# Altium schematic sheet proj_arhipov_mcu.SchDoc: =title_line_1 + title_line_2
size 840 x 594 mm; SheetNumber: 1
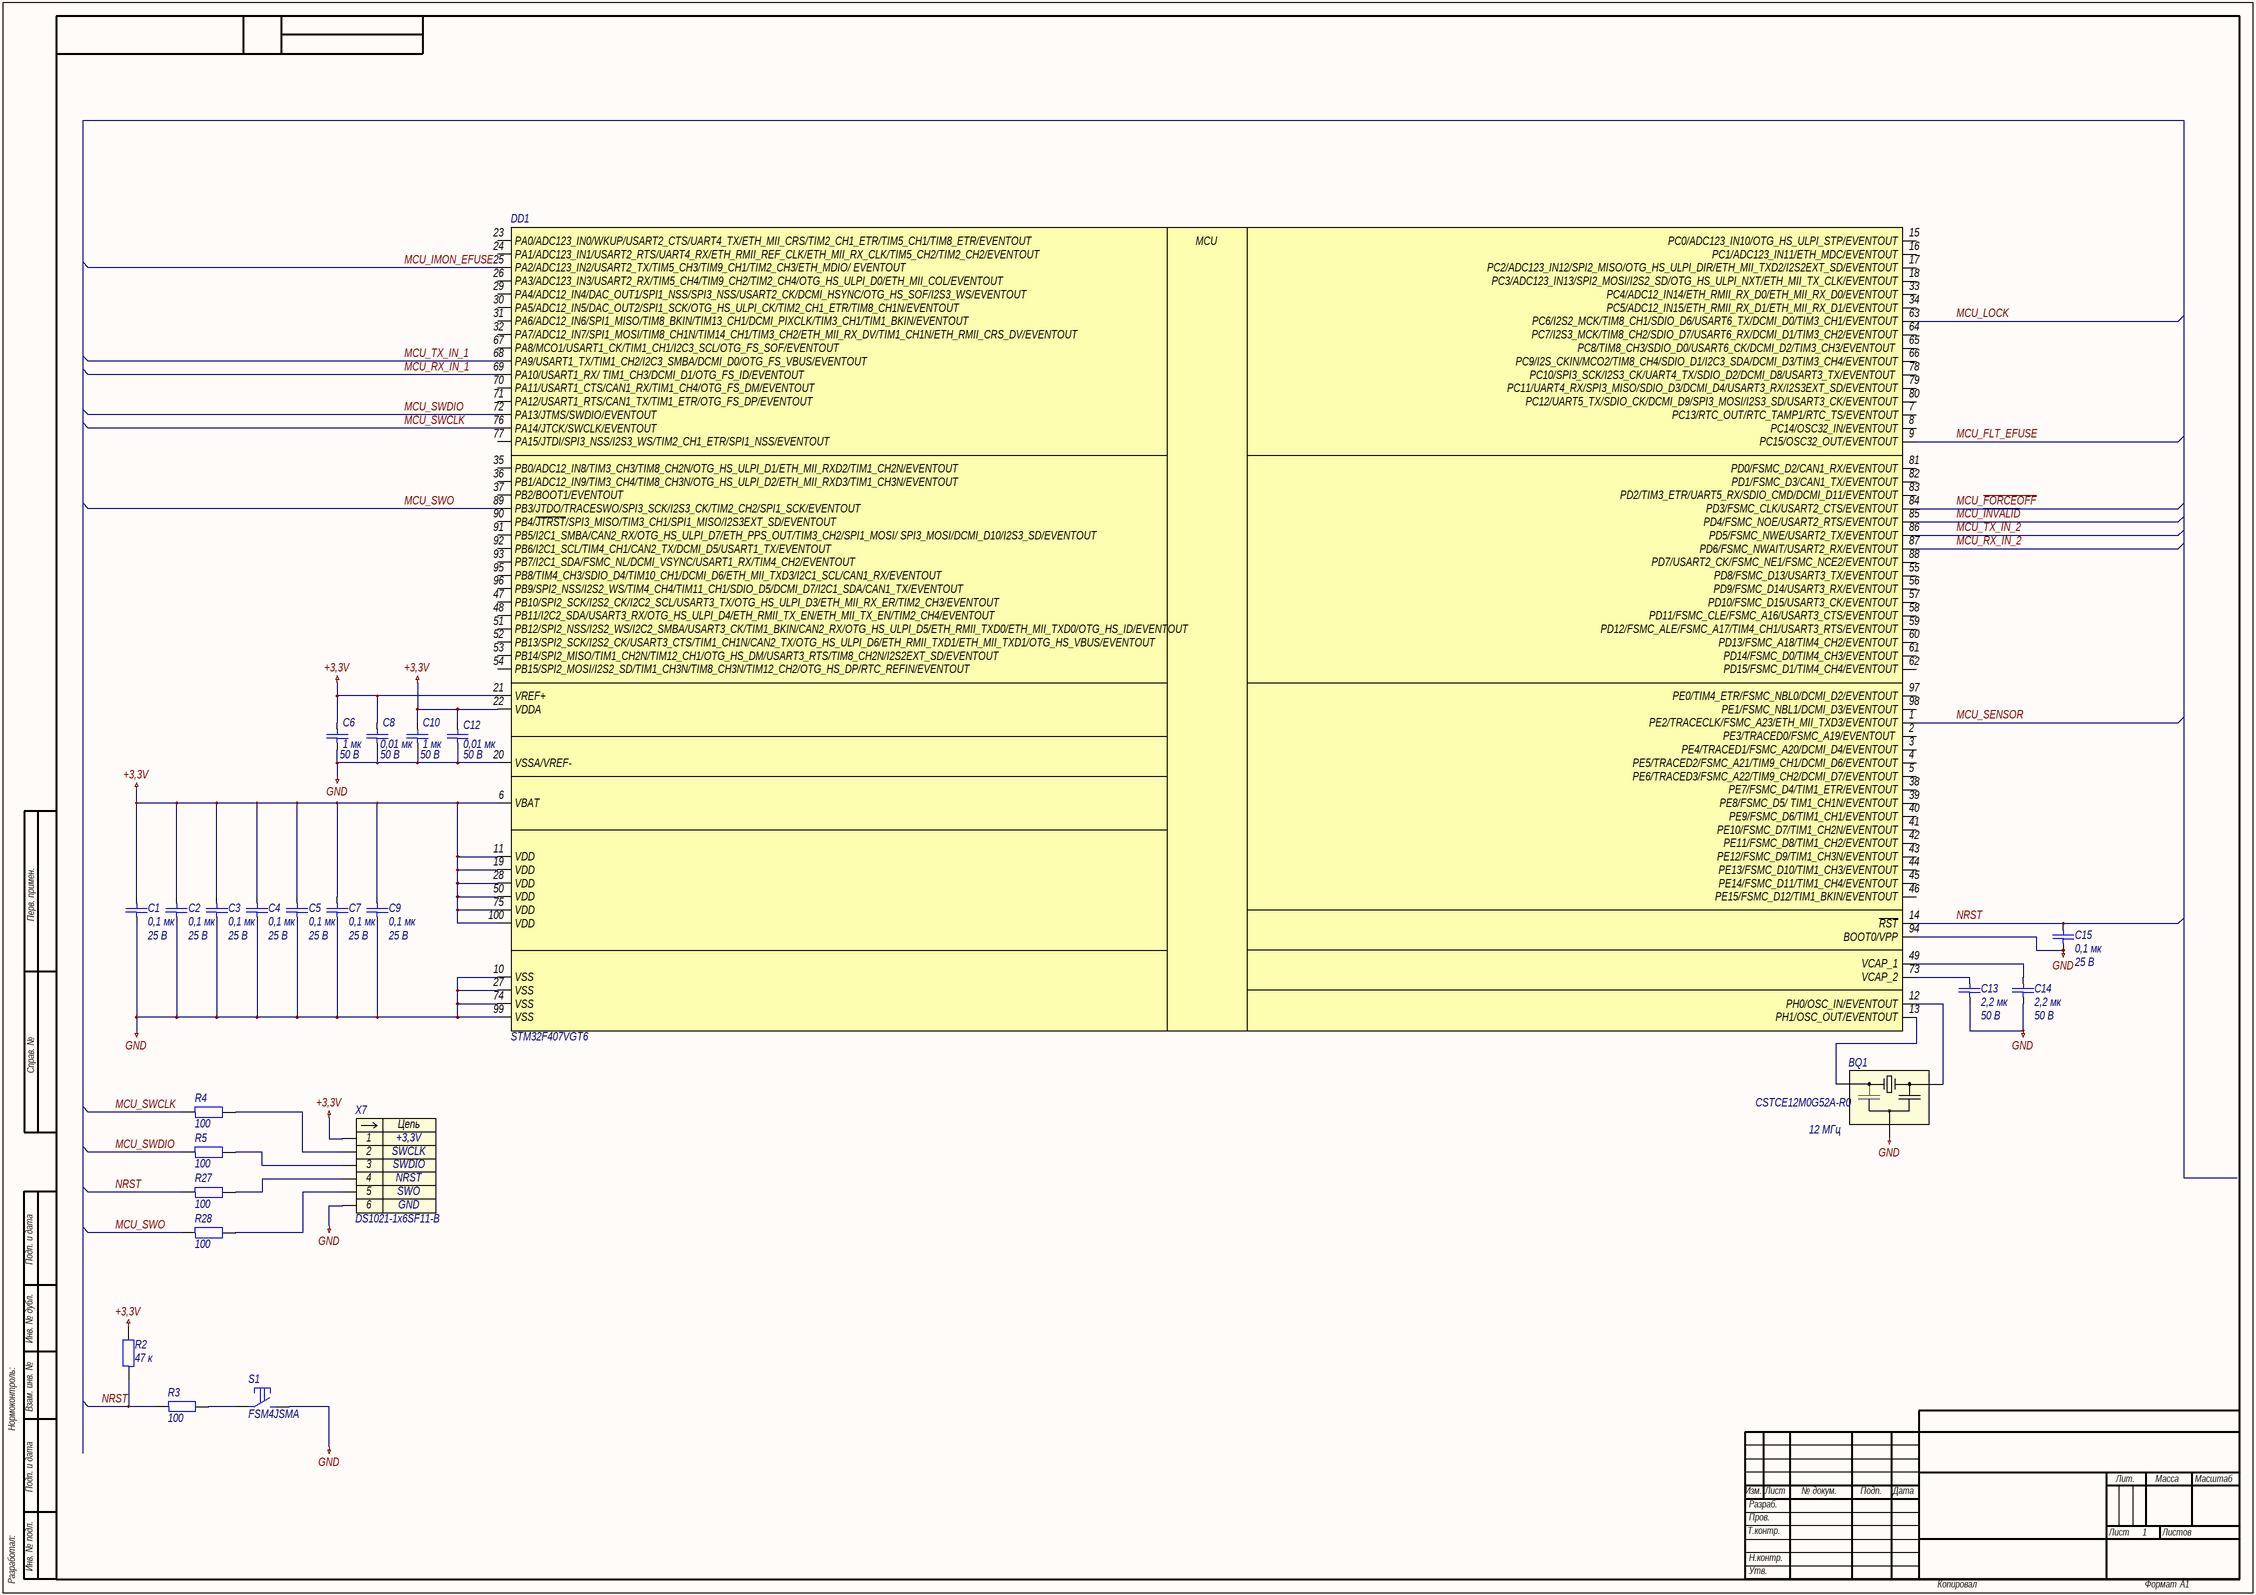
[diagram p0: proj_arhipov_mcu.SchDoc]

## Parts
BQ1  CSTCE12M0G52A-R0  Частотa: 12 МГц  [CSTCE-3-320X130X70]
C1  0,1 мк  Напряжение: 25 В  [C0603]
C2  0,1 мк  Напряжение: 25 В  [C0603]
C3  0,1 мк  Напряжение: 25 В  [C0603]
C4  0,1 мк  Напряжение: 25 В  [C0603]
C5  0,1 мк  Напряжение: 25 В  [C0603]
C6  1 мк  Напряжение: 50 В  [C0603]
C7  0,1 мк  Напряжение: 25 В  [C0603]
C8  0,01 мк  Напряжение: 50 В  [C0603]
C9  0,1 мк  Напряжение: 25 В  [C0603]
C10  1 мк  Напряжение: 50 В  [C0603]
C12  0,01 мк  Напряжение: 50 В  [C0603]
C13  2,2 мк  Напряжение: 50 В  [C0603]
C14  2,2 мк  Напряжение: 50 В  [C0603]
C15  0,1 мк  Напряжение: 25 В  [C0603]
DD1  STM32F407VGT6  [LQFP-100-P50-1400X1400X160-L60X22]
R2  47 к  [R0603]
R3  100  [R0603]
R4  100  [R0603]
R5  100  [R0603]
R27  100  [R0603]
R28  100  [R0603]
S1  FSM4JSMA  [FSM4JSMA]
X7  DS1021-1x6SF11-B  [DS1021-1X6SF11-B]

## Nets
+3,3V: C1.1 C2.1 C3.1 C4.1 C5.1 C6.1 C7.1 C8.1 C9.1 C10.1 C12.1 DD1.6(VBAT) DD1.11(VDD) DD1.19(VDD) DD1.21(VREF+) DD1.22(VDDA) DD1.28(VDD) DD1.50(VDD) DD1.75(VDD) DD1.100(VDD) R2.2 X7.1
GND: BQ1.2 C1.2 C2.2 C3.2 C4.2 C5.2 C6.2 C7.2 C8.2 C9.2 C10.2 C12.2 C13.2 C14.2 C15.2 DD1.10(VSS) DD1.20(VSSA/VREF-) DD1.27(VSS) DD1.74(VSS) DD1.94(BOOT0/VPP) DD1.99(VSS) S1.2 X7.6
MCU_~{FORCEOFF}: DD1.84(PD3/FSMC_CLK/USART2_CTS/EVENTOUT)
MCU_FLT_EFUSE: DD1.9(PC15/OSC32_OUT/EVENTOUT)
MCU_~{INVALID}: DD1.85(PD4/FSMC_NOE/USART2_RTS/EVENTOUT)
MCU_IMON_EFUSE: DD1.25(PA2/ADC123_IN2/USART2_TX/TIM5_CH3/TIM9_CH1/TIM2_CH3/ETH_MDIO/_EVENTOUT)
MCU_LOCK: DD1.63(PC6/I2S2_MCK/TIM8_CH1/SDIO_D6/USART6_TX/DCMI_D0/TIM3_CH1/EVENTOUT)
MCU_RX_IN_1: DD1.69(PA10/USART1_RX/_TIM1_CH3/DCMI_D1/OTG_FS_ID/EVENTOUT)
MCU_RX_IN_2: DD1.87(PD6/FSMC_NWAIT/USART2_RX/EVENTOUT)
MCU_SENSOR: DD1.1(PE2/TRACECLK/FSMC_A23/ETH_MII_TXD3/EVENTOUT)
MCU_SWCLK: DD1.76(PA14/JTCK/SWCLK/EVENTOUT) R4.1
MCU_SWDIO: DD1.72(PA13/JTMS/SWDIO/EVENTOUT) R5.1
MCU_SWO: DD1.89(PB3/JTDO/TRACESWO/SPI3_SCK/I2S3_CK/TIM2_CH2/SPI1_SCK/EVENTOUT) R28.1
MCU_TX_IN_1: DD1.68(PA9/USART1_TX/TIM1_CH2/I2C3_SMBA/DCMI_D0/OTG_FS_VBUS/EVENTOUT)
MCU_TX_IN_2: DD1.86(PD5/FSMC_NWE/USART2_TX/EVENTOUT)
NRST: C15.1 DD1.14(~{RST}) R2.1 R3.1 R27.1
NetBQ1_1: BQ1.1 DD1.12(PH0/OSC_IN/EVENTOUT)
NetBQ1_3: BQ1.3 DD1.13(PH1/OSC_OUT/EVENTOUT)
NetC13_1: C13.1 DD1.73(VCAP_2)
NetC14_1: C14.1 DD1.49(VCAP_1)
NetR3_2: R3.2 S1.1
NetR4_2: R4.2 X7.2
NetR5_2: R5.2 X7.3
NetR27_2: R27.2 X7.4
NetR28_2: R28.2 X7.5

Not connected (* = marked no-connect by the designer): DD1 2(PE3/TRACED0/FSMC_A19/EVENTOUT_) 3(PE4/TRACED1/FSMC_A20/DCMI_D4/EVENTOUT) 4(PE5/TRACED2/FSMC_A21/TIM9_CH1/DCMI_D6/EVENTOUT) 5(PE6/TRACED3/FSMC_A22/TIM9_CH2/DCMI_D7/EVENTOUT) 7(PC13/RTC_OUT/RTC_TAMP1/RTC_TS/EVENTOUT) 8(PC14/OSC32_IN/EVENTOUT) 15(PC0/ADC123_IN10/OTG_HS_ULPI_STP/EVENTOUT) 16(PC1/ADC123_IN11/ETH_MDC/EVENTOUT) 17(PC2/ADC123_IN12/SPI2_MISO/OTG_HS_ULPI_DIR/ETH_MII_TXD2/I2S2EXT_SD/EVENTOUT) 18(PC3/ADC123_IN13/SPI2_MOSI/I2S2_SD/OTG_HS_ULPI_NXT/ETH_MII_TX_CLK/EVENTOUT) 23(PA0/ADC123_IN0/WKUP/USART2_CTS/UART4_TX/ETH_MII_CRS/TIM2_CH1_ETR/TIM5_CH1/TIM8_ETR/EVENTOUT) 24(PA1/ADC123_IN1/USART2_RTS/UART4_RX/ETH_RMII_REF_CLK/ETH_MII_RX_CLK/TIM5_CH2/TIM2_CH2/EVENTOUT) 26(PA3/ADC123_IN3/USART2_RX/TIM5_CH4/TIM9_CH2/TIM2_CH4/OTG_HS_ULPI_D0/ETH_MII_COL/EVENTOUT) 29(PA4/ADC12_IN4/DAC_OUT1/SPI1_NSS/SPI3_NSS/USART2_CK/DCMI_HSYNC/OTG_HS_SOF/I2S3_WS/EVENTOUT) 30(PA5/ADC12_IN5/DAC_OUT2/SPI1_SCK/OTG_HS_ULPI_CK/TIM2_CH1_ETR/TIM8_CH1N/EVENTOUT) 31(PA6/ADC12_IN6/SPI1_MISO/TIM8_BKIN/TIM13_CH1/DCMI_PIXCLK/TIM3_CH1/TIM1_BKIN/EVENTOUT) 32(PA7/ADC12_IN7/SPI1_MOSI/TIM8_CH1N/TIM14_CH1/TIM3_CH2/ETH_MII_RX_DV/TIM1_CH1N/ETH_RMII_CRS_DV/EVENTOUT) 33(PC4/ADC12_IN14/ETH_RMII_RX_D0/ETH_MII_RX_D0/EVENTOUT) 34(PC5/ADC12_IN15/ETH_RMII_RX_D1/ETH_MII_RX_D1/EVENTOUT) 35(PB0/ADC12_IN8/TIM3_CH3/TIM8_CH2N/OTG_HS_ULPI_D1/ETH_MII_RXD2/TIM1_CH2N/EVENTOUT) 36(PB1/ADC12_IN9/TIM3_CH4/TIM8_CH3N/OTG_HS_ULPI_D2/ETH_MII_RXD3/TIM1_CH3N/EVENTOUT) 37(PB2/BOOT1/EVENTOUT) 38(PE7/FSMC_D4/TIM1_ETR/EVENTOUT) 39(PE8/FSMC_D5/_TIM1_CH1N/EVENTOUT) 40(PE9/FSMC_D6/TIM1_CH1/EVENTOUT) 41(PE10/FSMC_D7/TIM1_CH2N/EVENTOUT) 42(PE11/FSMC_D8/TIM1_CH2/EVENTOUT) 43(PE12/FSMC_D9/TIM1_CH3N/EVENTOUT) 44(PE13/FSMC_D10/TIM1_CH3/EVENTOUT) 45(PE14/FSMC_D11/TIM1_CH4/EVENTOUT) 46(PE15/FSMC_D12/TIM1_BKIN/EVENTOUT) 47(PB10/SPI2_SCK/I2S2_CK/I2C2_SCL/USART3_TX/OTG_HS_ULPI_D3/ETH_MII_RX_ER/TIM2_CH3/EVENTOUT) 48(PB11/I2C2_SDA/USART3_RX/OTG_HS_ULPI_D4/ETH_RMII_TX_EN/ETH_MII_TX_EN/TIM2_CH4/EVENTOUT) 51(PB12/SPI2_NSS/I2S2_WS/I2C2_SMBA/USART3_CK/TIM1_BKIN/CAN2_RX/OTG_HS_ULPI_D5/ETH_RMII_TXD0/ETH_MII_TXD0/OTG_HS_ID/EVENTOUT) 52(PB13/SPI2_SCK/I2S2_CK/USART3_CTS/TIM1_CH1N/CAN2_TX/OTG_HS_ULPI_D6/ETH_RMII_TXD1/ETH_MII_TXD1/OTG_HS_VBUS/EVENTOUT) 53(PB14/SPI2_MISO/TIM1_CH2N/TIM12_CH1/OTG_HS_DM/USART3_RTS/TIM8_CH2N/I2S2EXT_SD/EVENTOUT) 54(PB15/SPI2_MOSI/I2S2_SD/TIM1_CH3N/TIM8_CH3N/TIM12_CH2/OTG_HS_DP/RTC_REFIN/EVENTOUT) 55(PD8/FSMC_D13/USART3_TX/EVENTOUT) 56(PD9/FSMC_D14/USART3_RX/EVENTOUT) 57(PD10/FSMC_D15/USART3_CK/EVENTOUT) 58(PD11/FSMC_CLE/FSMC_A16/USART3_CTS/EVENTOUT) 59(PD12/FSMC_ALE/FSMC_A17/TIM4_CH1/USART3_RTS/EVENTOUT) 60(PD13/FSMC_A18/TIM4_CH2/EVENTOUT) 61(PD14/FSMC_D0/TIM4_CH3/EVENTOUT) 62(PD15/FSMC_D1/TIM4_CH4/EVENTOUT) 64(PC7/I2S3_MCK/TIM8_CH2/SDIO_D7/USART6_RX/DCMI_D1/TIM3_CH2/EVENTOUT) 65(PC8/TIM8_CH3/SDIO_D0/USART6_CK/DCMI_D2/TIM3_CH3/EVENTOUT_) 66(PC9/I2S_CKIN/MCO2/TIM8_CH4/SDIO_D1/I2C3_SDA/DCMI_D3/TIM3_CH4/EVENTOUT) 67(PA8/MCO1/USART1_CK/TIM1_CH1/I2C3_SCL/OTG_FS_SOF/EVENTOUT) 70(PA11/USART1_CTS/CAN1_RX/TIM1_CH4/OTG_FS_DM/EVENTOUT) 71(PA12/USART1_RTS/CAN1_TX/TIM1_ETR/OTG_FS_DP/EVENTOUT) 77(PA15/JTDI/SPI3_NSS/I2S3_WS/TIM2_CH1_ETR/SPI1_NSS/EVENTOUT) 78(PC10/SPI3_SCK/I2S3_CK/UART4_TX/SDIO_D2/DCMI_D8/USART3_TX/EVENTOUT_) 79(PC11/UART4_RX/SPI3_MISO/SDIO_D3/DCMI_D4/USART3_RX/I2S3EXT_SD/EVENTOUT) 80(PC12/UART5_TX/SDIO_CK/DCMI_D9/SPI3_MOSI/I2S3_SD/USART3_CK/EVENTOUT) 81(PD0/FSMC_D2/CAN1_RX/EVENTOUT) 82(PD1/FSMC_D3/CAN1_TX/EVENTOUT) 83(PD2/TIM3_ETR/UART5_RX/SDIO_CMD/DCMI_D11/EVENTOUT) 88(PD7/USART2_CK/FSMC_NE1/FSMC_NCE2/EVENTOUT) 90(PB4/~{JTRST}/SPI3_MISO/TIM3_CH1/SPI1_MISO/I2S3EXT_SD/EVENTOUT) 91(PB5/I2C1_SMBA/CAN2_RX/OTG_HS_ULPI_D7/ETH_PPS_OUT/TIM3_CH2/SPI1_MOSI/_SPI3_MOSI/DCMI_D10/I2S3_SD/EVENTOUT) 92(PB6/I2C1_SCL/TIM4_CH1/CAN2_TX/DCMI_D5/USART1_TX/EVENTOUT) 93(PB7/I2C1_SDA/FSMC_NL/DCMI_VSYNC/USART1_RX/TIM4_CH2/EVENTOUT) 95(PB8/TIM4_CH3/SDIO_D4/TIM10_CH1/DCMI_D6/ETH_MII_TXD3/I2C1_SCL/CAN1_RX/EVENTOUT) 96(PB9/SPI2_NSS/I2S2_WS/TIM4_CH4/TIM11_CH1/SDIO_D5/DCMI_D7/I2C1_SDA/CAN1_TX/EVENTOUT) 97(PE0/TIM4_ETR/FSMC_NBL0/DCMI_D2/EVENTOUT) 98(PE1/FSMC_NBL1/DCMI_D3/EVENTOUT)

## Notes on the sheet
- Перв. примен.
- Справ. №
- Подп. и дата
- Инв. № дубл.
- Нормоконтроль:
- Взам. инв. №
- Изм.
- Лист
- № докум.
- Подп.
- Дата
- Лит.
- Масса
- Масштаб
- Т.контр.
- Пров.
- Разраб.
- Листов
- Разработал:
- Инв. № подл.
- Н.контр.
- Утв.
- Копировал
- Формат
- А1
- (in symbol dd0001) MCU
- (in symbol x0016) Цепь

## Library data of the parts
BQ1 = bq0001: =Описание; ID: bq0001; Фамилия: Самарин; Описание: Кварцевый резонатор 12 МГц; Производитель: Murata Manufacturing Co., Ltd.; Корпус: 3,20 x 1,30 x 0,70; Наименование: CSTCE12M0G52A-R0; Частота: 12 МГц; HelpURL: https://www.murata.com/en-us/products/productdetail?partno=CSTCE12M0G52A-R0
C1-C5 C7 C9 C15 = c0058: =Описание; ID: c0058; Фамилия: Паньков; Описание: Конденсатор керамический чип 0603 100 нФ 25 В ±10 %; Наименование: CC0603KRX7R8BB104; Производитель: YAGEO Corp.; Отклонение: ±10 %; Рабочие температуры: от –55 °С до +125 °С; Температурный коэффициент емкости: X7R; Корпус: 0603; Номинал: 0,1 мк; Номинальное напряжение: 25 В; HelpURL: https://www.yageo.com/upload/media/product/productsearch/datasheet/mlcc/UPY-GPHC_X7R_6.3V-to-50V_20.pdf
C6 C10 = c0091: =Описание; ID: c0091; Фамилия: Самарин; Описание: Конденсатор керамический чип 0603 1 мкФ 50 В ±10 %; Наименование: CC0603KPX5R9BB105; Производитель: YAGEO Corp.; Отклонение: ±10 %; Рабочие температуры: от –55 °С до +85 °С; Температурный коэффициент емкости: X5R; Корпус: 0603; Номинал: 1 мк; Номинальное напряжение: 50 В; HelpURL: https://www.yageo.com/upload/media/product/productsearch/datasheet/mlcc/UPY-GPHC_X5R_4V-to-50V_26.pdf
C8 C12 = c0036: =Описание; ID: c0036; Фамилия: Паньков; Описание: Конденсатор керамический чип 0603 10 нФ 50 В ±10 %; Наименование: CC0603KRX7R9BB103; Производитель: YAGEO Corp.; Отклонение: ±10 %; Рабочие температуры: от –55 °С до +125 °С; Температурный коэффициент емкости: X7R; Корпус: 0603; Номинал: 0,01 мк; Номинальное напряжение: 50 В; HelpURL: https://www.yageo.com/upload/media/product/productsearch/datasheet/mlcc/UPY-GPHC_X7R_6.3V-to-50V_20.pdf
C13 C14 = c0102: =Описание; ID: c0102; Фамилия: Самарин; Описание: Конденсатор керамический чип 0603 2,2 мкФ 50 В ±10 %; Наименование: CC0603KRX5R9BB225; Производитель: YAGEO Corp.; Отклонение: ±10 %; Рабочие температуры: от –55 °С до +85 °С; Температурный коэффициент емкости: X5R; Корпус: 0603; Номинал: 2,2 мк; Номинальное напряжение: 50 В; HelpURL: https://www.yageo.com/upload/media/product/productsearch/datasheet/mlcc/UPY-GPHC_X5R_4V-to-50V_26.pdf
DD1 = dd0001: =Описание; ID: dd0001; Фамилия: Паньков; Описание: ARM Cortex-M4 32-разрядный микроконтроллер 168 МГц 1 Мбайт FLASH-памяти; Производитель: STMicroelectronics; Рабочее напряжение: от 1,8 В до 3,6 В; Максимальная тактовая частота: 168 МГц; Поддерживаемые интерфейсы: CAN, I2C, SDIO, I2S/SPI, UART/USART, USB; Рабочие температуры: от –40 °С до +85 °С; Корпус: LQFP-100; Наименование: STM32F407VGT6; HelpURL: https://www.st.com/en/microcontrollers-microprocessors/stm32f407vg.html
R2 = r0084: =Описание; ID: r0084; Фамилия: Паньков; Описание: Резистор чип 0603 47 кОм ±1 % 0,1 Вт; Наименование: RC0603FR-0747KL; Производитель: YAGEO Corp.; Отклонение: ±1 %; Номинальное напряжение: 75 В; Номинальный ток: 1 А; Рабочие температуры: от –55 °С до +155 °С; Корпус: 0603; Примечание: Ряд E24; Номинал: 47 к; HelpURL: https://www.yageo.com/upload/media/product/productsearch/datasheet/rchip/PYu-RC_Group_51_RoHS_L_11.pdf
R3-R5 R27 R28 = r0007: =Описание; ID: r0007; Фамилия: Самарин; Описание: Резистор чип 0603 100 Ом ±1 % 0,1 Вт; Наименование: RC0603FR‍‐07100RL; Производитель: YAGEO Corp.; Отклонение: ±1 %; Номинальное напряжение: 75 В; Номинальный ток: 1 А; Рабочие температуры: от –55 °С до +155 °С; Корпус: 0603; Примечание: Ряд E24; Номинал: 100; HelpURL: https://www.yageo.com/upload/media/product/productsearch/datasheet/rchip/PYu-RC_Group_51_RoHS_L_11.pdf
S1 = s0001: =Описание; ID: s0001; Фамилия: Паньков; Описание: Тактовая кнопка поверхностного монтажа; Производитель: TE Connectivity; Ток нагрузки: 50 мА @ 24 В; Сопротивление контакта: 100 мОм; Количество контактов: 4; Рабочие температуры: от –35 °С до +85 °С; Промывка: Запрещена; Корпус: 6,00 x 6,00 x 4,98; Наименование: FSM4JSMA; HelpURL: https://www.te.com/usa-en/product-4-1437565-1.html
X7 = x0016: =Описание; Contact_1: +3,3V; Contact_2: SWCLK; Contact_3: SWDIO; Contact_4: NRST; Contact_5: SWO; Contact_6: GND; ID: x0016; Фамилия: Паньков; Описание: PLS 6 pin 2,54 мм вилка прямой; Производитель: Connfly Electronic Co., Ltd.; Наименование: DS1021-1x6SF11-B; HelpURL: http://en.connfly.group/product/xVkr=EusQssAN0gN=Aos=mU+UrVkR9kqEAN0gN9g+WqANB+A